# EAGLE design filter (EAGLE 9.6.2)
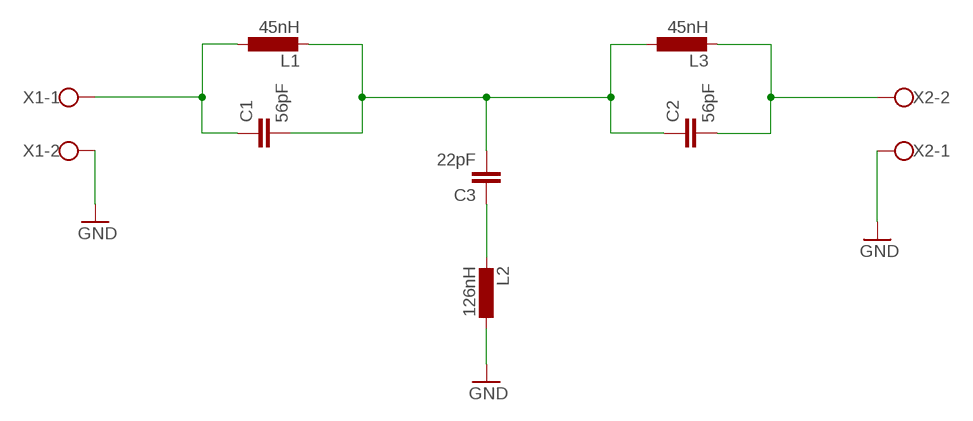
[diagram p0: schematic, sheet 1]

## Parts
C1  56pF  C-EUC0805K  [C0805K]
C2  56pF  C-EUC0805K  [C0805K]
C3  22pF  C-EUC0805K  [C0805K]
L1  45nH  L-EU0204/7  [0204/7]
L2  126nH  L-EU0207/10  [0207/10]
L3  45nH  L-EU0204/7  [0204/7]
X1  W237-102  [W237-102]
X2  W237-102  [W237-102]

## Nets
GND: L2.1 X1.2 X2.1
N$1: C1.1 L1.1 X1.1
N$2: C1.2 C2.1 C3.2 L1.2 L3.1
N$3: C2.2 L3.2 X2.2
N$4: C3.1 L2.2

## Library data of the parts
C1-C3 = rcl:C-EU: CAPACITOR, European symbol; SPICEPREFIX: C
L1-L3 = rcl:L-EU: INDUCTOR, European symbol; SPICEPREFIX: L
X1 X2 = con-wago-500:W237-102: WAGO SCREW CLAMP; MPN: 237-102; OC_FARNELL: unknown; OC_NEWARK: 70K9898

## Board
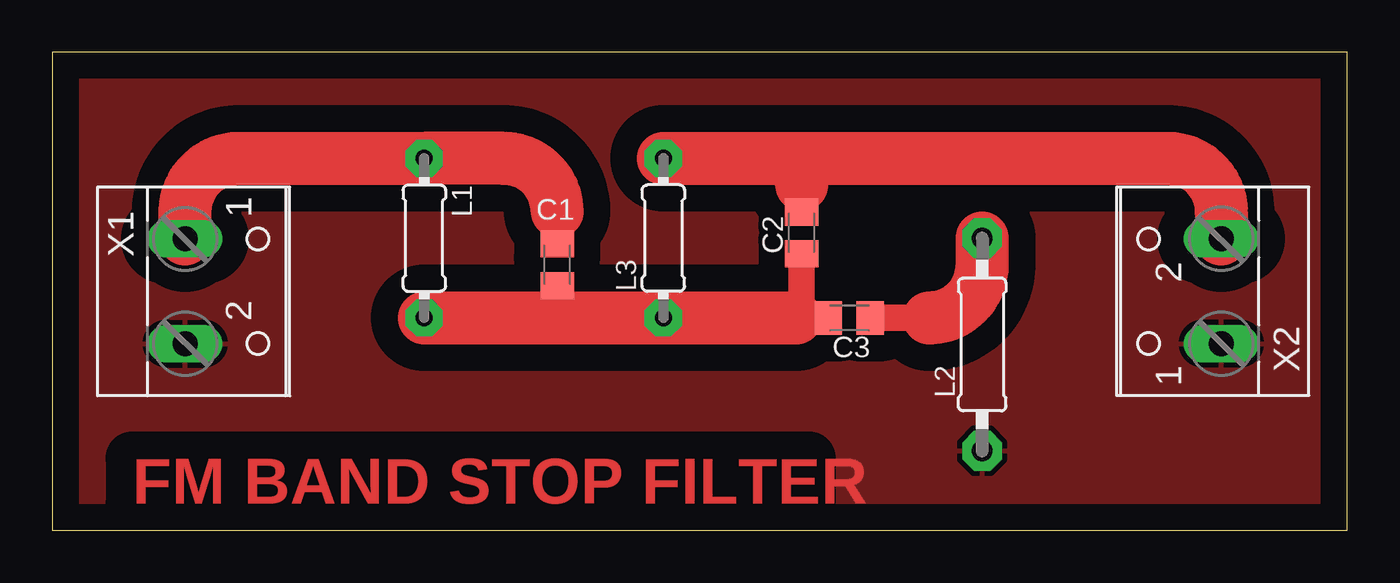
[diagram p1: board, top side]

Size 61.9 x 22.85 mm. Coordinates in mm from the lower left corner, seen from the top.
Outline: 0,0 61.9,0 61.9,22.85 0,22.85 0,0
Copper layers (1*16): Top 0.035mm / dielectric 1.5mm / Bottom 0.035mm
Design rules "default": minimum track width 6mil, minimum drill 0.35mm, track to track 6mil, track to pad 6mil, pad to pad 6mil, via to via 6mil, smd to smd 6mil, copper to edge 40mil, drill to drill 6mil, minimum pad ring 10mil, minimum via ring 8mil, stop-mask expansion 4mil, vias tented up to drill 0mil, thermal gap 10mil

### Footprints (pad centres in the part's own frame; a part is rotated, then mirrored left to right if it is on the bottom)
C0805K = smd 1.3 x 1.6: 1 -1,0; 2 1,0
0204/7 = drill 0.813 pad 1.778 octagon: 1 -3.81,0; 2 3.81,0
0207/10 = drill 1 pad 1.905 octagon: 1 -5.08,0; 2 5.08,0
W237-102 = drill 1.194 long: 1 -2.5,-1.27; 2 2.5,-1.27

### Placement (x,y rotation side)
C1  24.13,12.7 270 top
C2  35.81,14.22 90 top
C3  38.1,10.16 180 top
L1  17.78,13.97 270 top
L2  44.45,8.89 90 top
L3  29.21,13.97 90 top
X1  7.62,11.43 270 top
X2  54.61,11.43 90 top

### Tracks (layer width: path | path; a pad name or v marks a point on that pad's centre or on a via)
GND
  pour Top (isolate 1.27): -1.27,24.13 -1.27,-1.27 63.5,-1.27 63.5,24.13
N$1
  Top 1.27: C1.1 24.13,15.24
  Top 2.54: X1.1 6.35,15.24 arc-90 8.89,17.78 L1.1 21.59,17.78 arc-90 24.13,15.24
N$2
  Top 1.27: 24.13,10.16 C1.2 | C2.1 35.81,10.16 C3.2 35.56,10.16
  Top 2.54: L1.2 24.13,10.16 L3.1 35.56,10.16
N$3
  Top 1.27: 35.81,15.24 C2.2 35.81,16.51 35.81,17.53
  Top 2.54: X2.2 55.88,15.24 arc90 53.34,17.78 L3.2 34.54,17.78 arc-90 35.81,16.51
N$4
  Top 1.27: C3.1 41.91,10.16
  Top 2.54: 41.91,10.16 arc90 44.45,12.7 L2.2

### Text on the board
Top: FM BAND STOP FILTER